# Altium schematic sheet ETH.SchDoc
size A4; DocumentNumber: 10; SheetNumber: 10; SheetTotal: 15
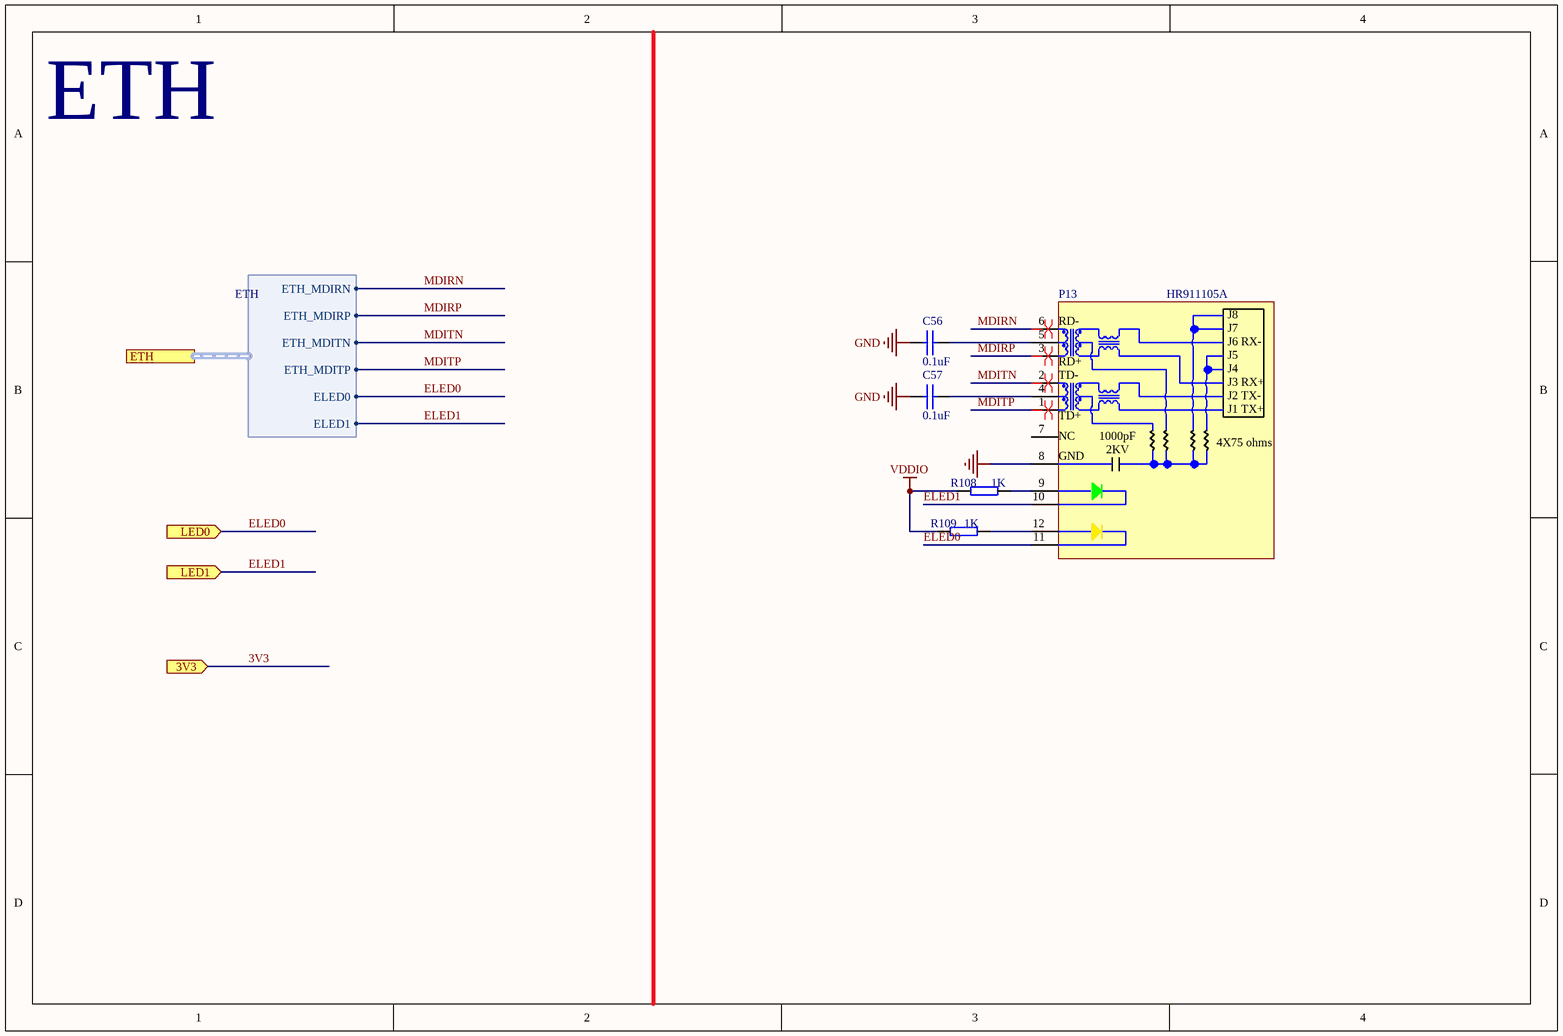
[diagram p0: ETH.SchDoc]

## Parts
C56  0.1uF  [0402_C]
C57  0.1uF  [0402_C]
P13  HR911105A  [HR911105A]
R108  1K  [0402]
R109  1K  [0402]

## Ports
3V3 (in), ETH (harness ETH), LED0 (in), LED1 (in)

## Harnesses
ETH: ETH_MDIRN, ETH_MDIRP, ETH_MDITN, ETH_MDITP, ELED0, ELED1

## Nets
GND: C56.1 C57.1 P13.8
VDDIO: R108.1 R109.1
3V3: port 3V3
ELED0: P13.11 ; port LED0, port ETH.ELED0
ELED1: P13.10 ; port LED1, port ETH.ELED1
MDIRN: P13.6 ; port ETH.ETH_MDIRN
MDIRP: P13.3 ; port ETH.ETH_MDIRP
MDITN: P13.2 ; port ETH.ETH_MDITN
MDITP: P13.1 ; port ETH.ETH_MDITP
NetC56_2: C56.2 P13.5
NetC57_2: C57.2 P13.4
NetP13_9: P13.9 R108.2
NetP13_12: P13.12 R109.2

Not connected (* = marked no-connect by the designer): P13 7

## Layout directives
differential pair: MDIRN, MDIRP, MDITN, MDITP

## Notes on the sheet
- ETH
- (in symbol HR911105A) J8; RD-; J7; J6; RX-; J5; RD+; J4; TD-; J3; RX+; J2; TX-; J1; TX+; TD+; NC; 1000pF; 4X75 ohms; 2KV; GND

## Library data of the parts
C56 C57 = CAP: Capacitor
R108 R109 = RES